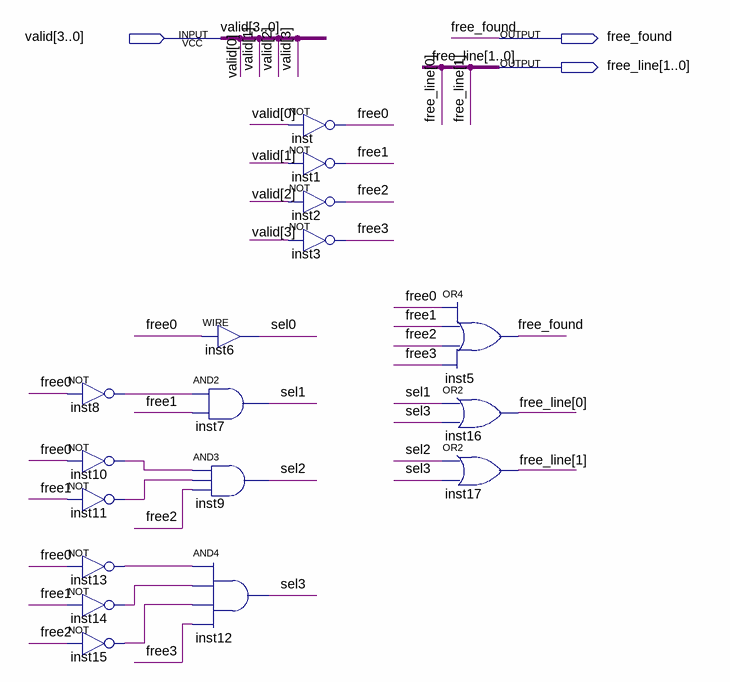
[diagram p0: schematic sheet]
// Quartus schematic free_line_select.bdf as structural Verilog: 17 symbols, 3 pins
module free_line_select (
  input  [3:0] valid,
  output free_found,
  output [1:0] free_line
);

  wire free0, free1, free2, free3, inst8_out, inst10_out, inst11_out, inst13_out, inst14_out, inst15_out,
       sel0, sel1, sel2, sel3;

  not inst8 (inst8_out, free0);
  not inst10 (inst10_out, free0);
  not inst11 (inst11_out, free1);
  not inst13 (inst13_out, free0);
  not inst14 (inst14_out, free1);
  not inst15 (inst15_out, free2);
  assign sel0 = free0;  // WIRE inst6
  and inst7 (sel1, inst8_out, free1);
  and inst9 (sel2, inst10_out, inst11_out, free2);
  and inst12 (sel3, inst13_out, inst14_out, inst15_out, free3);
  not inst (free0, valid[0]);
  not inst1 (free1, valid[1]);
  not inst2 (free2, valid[2]);
  not inst3 (free3, valid[3]);
  or inst5 (free_found, free0, free1, free2, free3);
  or inst16 (free_line[0], sel1, sel3);
  or inst17 (free_line[1], sel2, sel3);
endmodule
